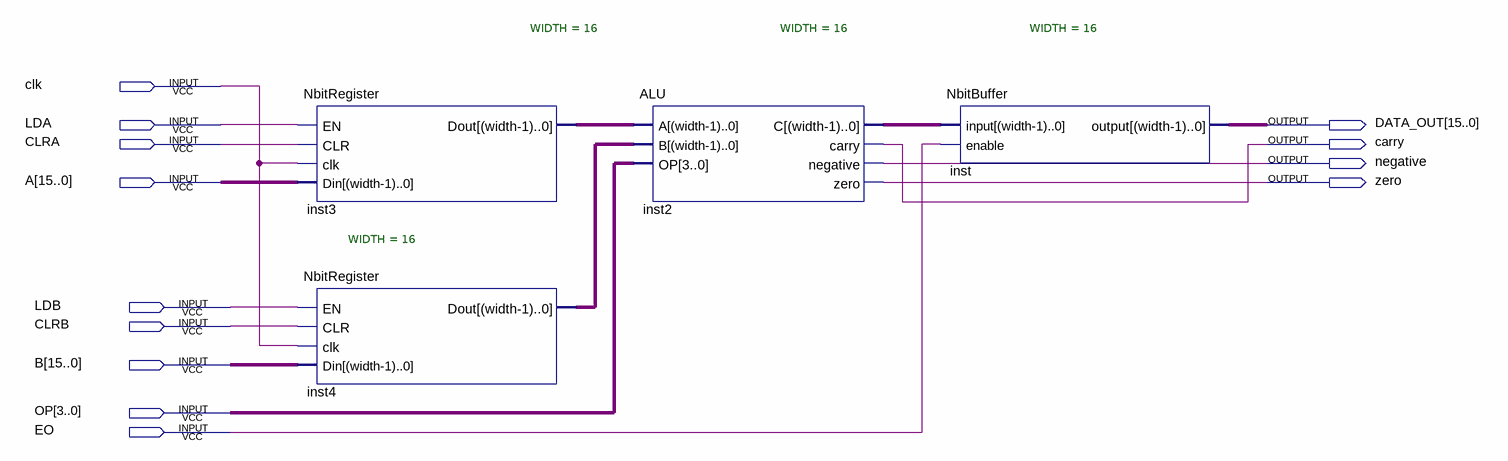
[diagram p0: schematic sheet]
// Quartus schematic RB_ALU.bdf as structural Verilog: 4 symbols, 13 pins
module RB_ALU (
  input  clk,
  input  LDA,
  input  CLRA,
  input  [15:0] A,
  input  LDB,
  input  CLRB,
  input  [15:0] B,
  input  [3:0] OP,
  input  EO,
  output [15:0] DATA_OUT,
  output carry,
  output negative,
  output zero
);

  wire [15:0] inst2_c, inst3_dout, inst4_dout;

  NbitRegister #(.WIDTH(16)) inst3 (.EN(LDA), .CLR(CLRA), .clk(clk), .Din(A), .Dout(inst3_dout));
  NbitRegister #(.WIDTH(16)) inst4 (.EN(LDB), .CLR(CLRB), .clk(clk), .Din(B), .Dout(inst4_dout));
  ALU #(.WIDTH(16)) inst2 (
    .A(inst3_dout), .B(inst4_dout), .OP(OP), .C(inst2_c), .carry(carry), .negative(negative), .zero(zero));
  NbitBuffer #(.WIDTH(16)) inst (.\input (inst2_c), .enable(EO), .\output (DATA_OUT));
endmodule
